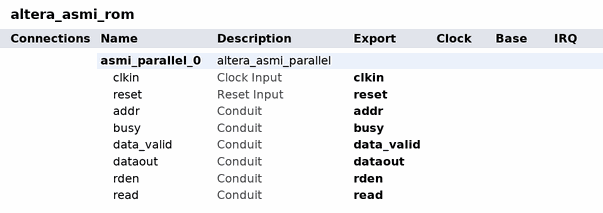
[diagram p0: system contents]
# Platform Designer (Qsys) system altera_asmi_rom, Cyclone IV E EP4CE115F29C7
# Parameters at their usual value, and those the tool derives, are not listed.
package require -exact qsys 15.1
create_system altera_asmi_rom
set_project_property DEVICE_FAMILY {Cyclone IV E}
set_project_property DEVICE EP4CE115F29C7

add_instance asmi_parallel_0 altera_asmi_parallel 15.1
set_instance_property asmi_parallel_0 AUTO_EXPORT true
set_instance_parameter_value asmi_parallel_0 CBX_AUTO_BLACKBOX ALL
set_instance_parameter_value asmi_parallel_0 DATA_WIDTH STANDARD
set_instance_parameter_value asmi_parallel_0 ENABLE_SIM false
set_instance_parameter_value asmi_parallel_0 EPCS_TYPE EPCS64
set_instance_parameter_value asmi_parallel_0 FLASH_RSTPIN FALSE
set_instance_parameter_value asmi_parallel_0 PAGE_SIZE 1
set_instance_parameter_value asmi_parallel_0 WRITE_DUMMY_CLK 0
set_instance_parameter_value asmi_parallel_0 gui_bulk_erase false
set_instance_parameter_value asmi_parallel_0 gui_die_erase false
set_instance_parameter_value asmi_parallel_0 gui_ex4b_addr false
set_instance_parameter_value asmi_parallel_0 gui_fast_read false
set_instance_parameter_value asmi_parallel_0 gui_page_write false
set_instance_parameter_value asmi_parallel_0 gui_read_address false
set_instance_parameter_value asmi_parallel_0 gui_read_dummyclk false
set_instance_parameter_value asmi_parallel_0 gui_read_rdid false
set_instance_parameter_value asmi_parallel_0 gui_read_sid false
set_instance_parameter_value asmi_parallel_0 gui_read_status false
set_instance_parameter_value asmi_parallel_0 gui_sector_erase false
set_instance_parameter_value asmi_parallel_0 gui_sector_protect false
set_instance_parameter_value asmi_parallel_0 gui_single_write false
set_instance_parameter_value asmi_parallel_0 gui_use_asmiblock false
set_instance_parameter_value asmi_parallel_0 gui_use_eab false
set_instance_parameter_value asmi_parallel_0 gui_wren false
set_instance_parameter_value asmi_parallel_0 gui_write false

# exported interfaces
add_interface addr conduit end
set_interface_property addr EXPORT_OF asmi_parallel_0.addr
add_interface busy conduit end
set_interface_property busy EXPORT_OF asmi_parallel_0.busy
add_interface clkin clock sink
set_interface_property clkin EXPORT_OF asmi_parallel_0.clkin
add_interface data_valid conduit end
set_interface_property data_valid EXPORT_OF asmi_parallel_0.data_valid
add_interface dataout conduit end
set_interface_property dataout EXPORT_OF asmi_parallel_0.dataout
add_interface rden conduit end
set_interface_property rden EXPORT_OF asmi_parallel_0.rden
add_interface read conduit end
set_interface_property read EXPORT_OF asmi_parallel_0.read
add_interface reset reset sink
set_interface_property reset EXPORT_OF asmi_parallel_0.reset

set_interconnect_requirement {$system} qsys_mm.clockCrossingAdapter HANDSHAKE
set_interconnect_requirement {$system} qsys_mm.enableEccProtection FALSE
set_interconnect_requirement {$system} qsys_mm.insertDefaultSlave FALSE
set_interconnect_requirement {$system} qsys_mm.maxAdditionalLatency 1

save_system altera_asmi_rom.qsys
